# Altium schematic sheet LED-Driver-Sheet.SchDoc
size A; DocumentNumber: 4; SheetNumber: 4; SheetTotal: 5
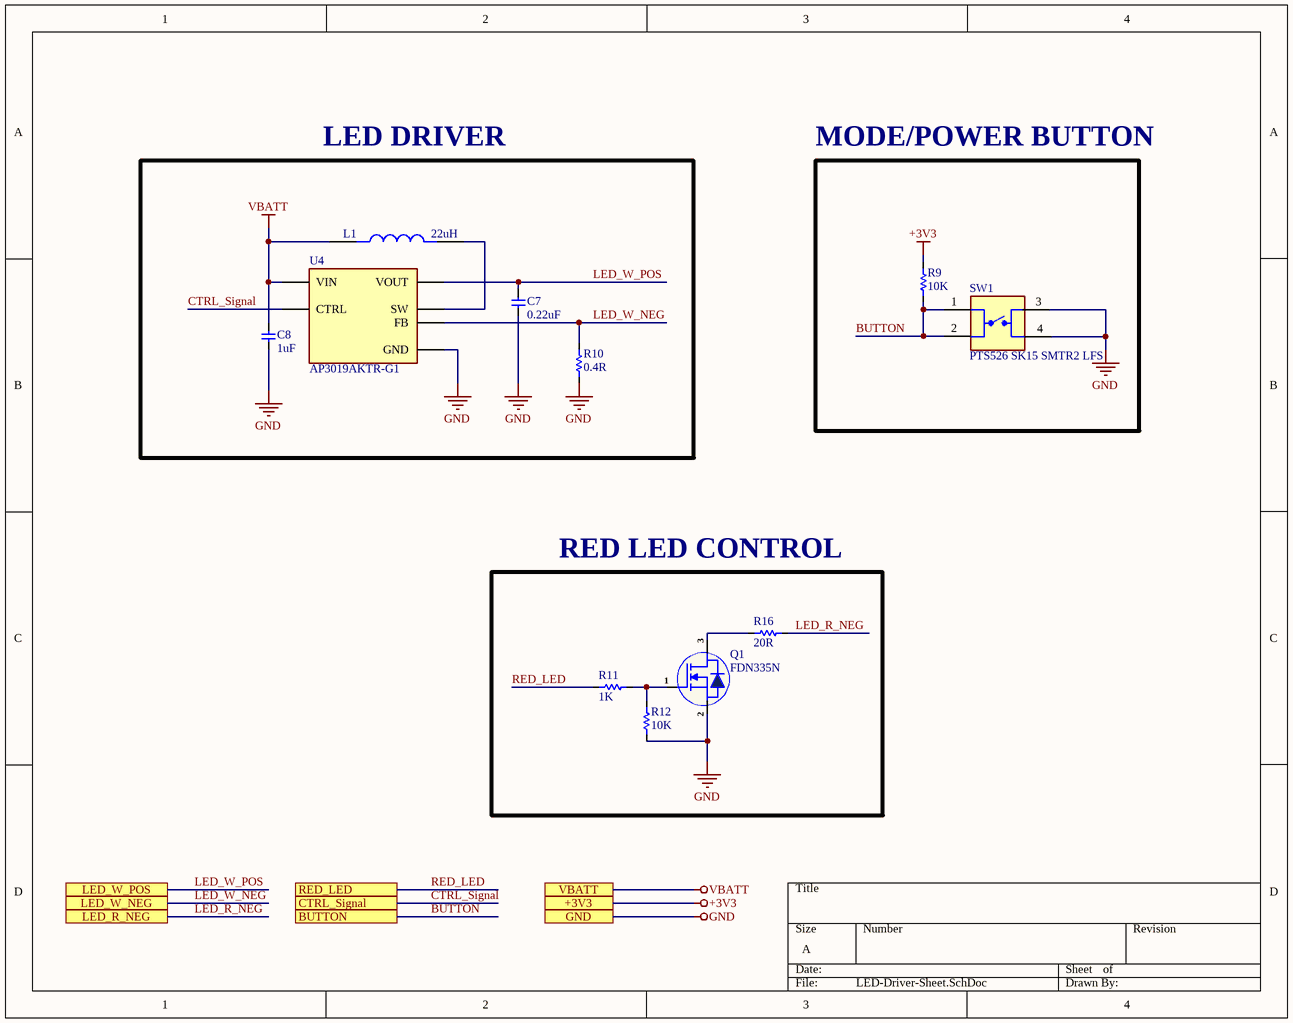
[diagram p0: LED-Driver-Sheet.SchDoc]

## Parts
C7  0.22uF  [Cap-0402]
C8  1uF  [Cap-0402]
L1  22uH  [IND_1235AS-H-220M=P3]
Q1  FDN335N  [SOT-23]
R9  10K  [Res-0402]
R10  0.4R  [Res-1206]
R11  1K  [Res-0402]
R12  10K  [Res-0402]
R16  20R  [RESC1005X40N]
SW1  PTS526 SK15 SMTR2 LFS  [PTS525SM15SMTR2LFS]
U4  AP3019AKTR-G1  [AP3019AKTR-G1]

## Blocks framed on the sheet
LED DRIVER: C7 C8 L1 R10 U4
MODE/POWER BUTTON: R9 SW1
RED LED CONTROL: Q1 R11 R12 R16

## Ports
+3V3 (see Top-Sheet[2A], Connector-Sheet[2D], Controller-Sheet[2D], Power-Sheet[2D]), BUTTON (see Top-Sheet[3B], Controller-Sheet[1D]), CTRL_Signal (see Top-Sheet[3B], Controller-Sheet[1D]), GND (see Top-Sheet[2A], Connector-Sheet[2D], Controller-Sheet[2D], Power-Sheet[2D]), LED_R_NEG (see Top-Sheet[2B], Connector-Sheet[1D]), LED_W_NEG (see Top-Sheet[2B], Connector-Sheet[1D]), LED_W_POS (see Top-Sheet[2B], Connector-Sheet[1D]), RED_LED (see Top-Sheet[3B], Controller-Sheet[1D]), VBATT (see Top-Sheet[2A], Connector-Sheet[2D], Controller-Sheet[2D], Power-Sheet[2D])

## Nets
+3V3: R9.1 ; port +3V3
GND: C7.1 C8.1 Q1.2(S) R10.1 R12.2 SW1.3 SW1.4 U4.2(GND) ; port GND
VBATT: C8.2 L1.1 U4.6(VIN) ; port VBATT
BUTTON: R9.2 SW1.1 SW1.2 ; port BUTTON
CTRL_Signal: U4.4(CTRL) ; port CTRL_Signal
LED_R_NEG: R16.2 ; port LED_R_NEG
LED_W_NEG: R10.2 U4.3(FB) ; port LED_W_NEG
LED_W_POS: C7.2 U4.5(VOUT) ; port LED_W_POS
RED_LED: R11.1 ; port RED_LED
NetL1_2: L1.2 U4.1(SW)
NetQ1_1: Q1.1(G) R11.2 R12.1
NetQ1_3: Q1.3(D) R16.1

## Library data of the parts
C7 = CC0402KRX5R8BB224: 0.22 µF ±10% 25V Ceramic Capacitor X5R 0402 (1005 Metric); Manufacturer: YAGEO; Manufacturer Part Number: CC0402KRX5R8BB224; Digikey Part Number: 311-3341-6-ND; Item Type: Capacitor; Package: 0402; ComponentLink1Description: Digikey Link; ComponentLink1URL: https://www.digikey.com/en/products/detail/yageo/CC0402KRX5R8BB224/5883337?s=N4IgTCBcDaIMJwAwBZFgNICUAaBWTAHAEJFhjIgC6AvkA
C8 = GRM033R60J105MEA2D: 1 µF ±20% 6.3V Ceramic Capacitor X5R 0201 (0603 Metric); Manufacturer: Murata Electronics; Manufacturer Part Number: GRM033R60J105MEA2D; Digikey Part Number: 490-7229-6-ND; Item Type: Capacitor; Package: 0201; ComponentLink1Description: Digikey Link; ComponentLink1URL: https://www.digikey.com/en/products/detail/murata-electronics/GRM033R60J105MEA2D/4213369
L1 = 1235AS-H-220M=P3: Inductor Power Shielded Wirewound 22uH 20% 100KHz Ferrite 1A 0.306Ohm DCR 1818 T/R; Manufacturer: Murata Electronics; Package: None; Manufacturer Part Number: 1235AS-H-220M=P3; Digikey Part Number: 490-14209-6-ND; ComponentLink1Description: Digikey Link; ComponentLink1URL: https://www.digikey.com/en/products/detail/murata-electronics/1235AS-H-220M-P3/6205726; Item Type: Inductor
Q1 = FDN335N: SOT-23 MOSFETs ROHS; Manufacturer: onsemi; Item Type: Mosfet; Manufacturer Part Number: FDN335N; Package: SOT-23; Digikey Part Number: FDN335NDKR-ND; ComponentLink1Description: Digikey Link; ComponentLink1URL: https://www.digikey.com/en/products/detail/onsemi/FDN335N/965301
R9 R12 = RC0603FR-0710KL: 10 kOhms ±1% 0.063W, 1/16W Chip Resistor 0402 (1005 Metric) Moisture Resistant Thick Film; Manufacturer: YAGEO; Manufacturer Part Number: RC0402FR-0710KL; Digikey Part Number: 311-10.0KLRDKR-ND; Item Type: Resistor; Package: 0402; ComponentLink1Description: Digikey Link; ComponentLink1URL: https://www.digikey.com/en/products/detail/yageo/RC0402FR-0710KL/726523
R10 = RL1206FR-070R4L: 400 mOhms ±1% 0.25W, 1/4W Chip Resistor 1206 (3216 Metric) Automotive AEC-Q200, Current Sense, Moisture Resistant Thick Film; Manufacturer: YAGEO; Manufacturer Part Number: RL1206FR-070R4L; Digikey Part Number: 311-.4LWDKR-ND; Item Type: Resistor; Package: 1206; ComponentLink1Description: Digikey Link; ComponentLink1URL: https://www.digikey.com/en/products/detail/yageo/RL1206FR-070R4L/3886028
R11 = RC0402FR-071KL: 1 kOhms ±1% 0.063W, 1/16W Chip Resistor 0402 (1005 Metric) Moisture Resistant Thick Film; Manufacturer: YAGEO; Manufacturer Part Number: RC0402FR-071KL; Digikey Part Number: 311-1.00KLRDKR-ND; Item Type: Resistor; Package: 0402; ComponentLink1Description: Digikey Link; ComponentLink1URL: https://www.digikey.com/en/products/detail/yageo/RC0402FR-071KL/726513
R16 = RCS040220R0FKED: 20 Ohms ±1% 0.2W, 1/5W Chip Resistor 0402 (1005 Metric) Automotive AEC-Q200, Pulse Withstanding Thick Film; Manufacturer: Vishay Dale; Manufacturer Part Number: RCS040220R0FKED; Digikey Part Number: 541-RCS040220R0FKEDDKR-ND; Item Type: Resistor; Package: 0402; ComponentLink1Description: Digikey Link; ComponentLink1URL: https://www.digikey.com/en/products/detail/vishay-dale/RCS040220R0FKED/5867510
SW1 = MCSLPT4644B1PHTR: Tactile Switch SPST-NO Top Actuated Surface Mount; Manufacturer: TE Connectivity ALCOSWITCH Switches; Manufacturer Part Number: MCSLPT4644B1PHTR; Digikey Part Number: 450-3383-6-ND; Item Type: Switch; ComponentLink1Description: Digikey Link; ComponentLink1URL: https://www.digikey.com/en/products/detail/te-connectivity-alcoswitch-switches/MCSLPT4644B1PHTR/9686564; Package: SMD
U4 = AP3019AKTR-G1: LED Driver IC 1 Output DC DC Regulator Step-Up (Boost) PWM Dimming 550mA (Switch) SOT-23-6; Manufacturer: Diodes Incorporated; Manufacturer Part Number: AP3019AKTR-G1; ComponentLink1Description: Digikey Link; ComponentLink1URL: https://www.digikey.com/en/products/detail/diodes-incorporated/AP3019AKTR-G1/4470850?s=N4IgTCBcDaIIIAUDMAGAjATjgaQCoCUBaAcTRAF0BfIA; Supplier Part Number: AP3019AKTR-G1DIDKR-ND; Item Type: LED Driver; Package: SOT-23-6; Digikey Part Number: AP3019AKTR-G1DIDKR-ND